# EAGLE design c200_rev_a (EAGLE 6.1)
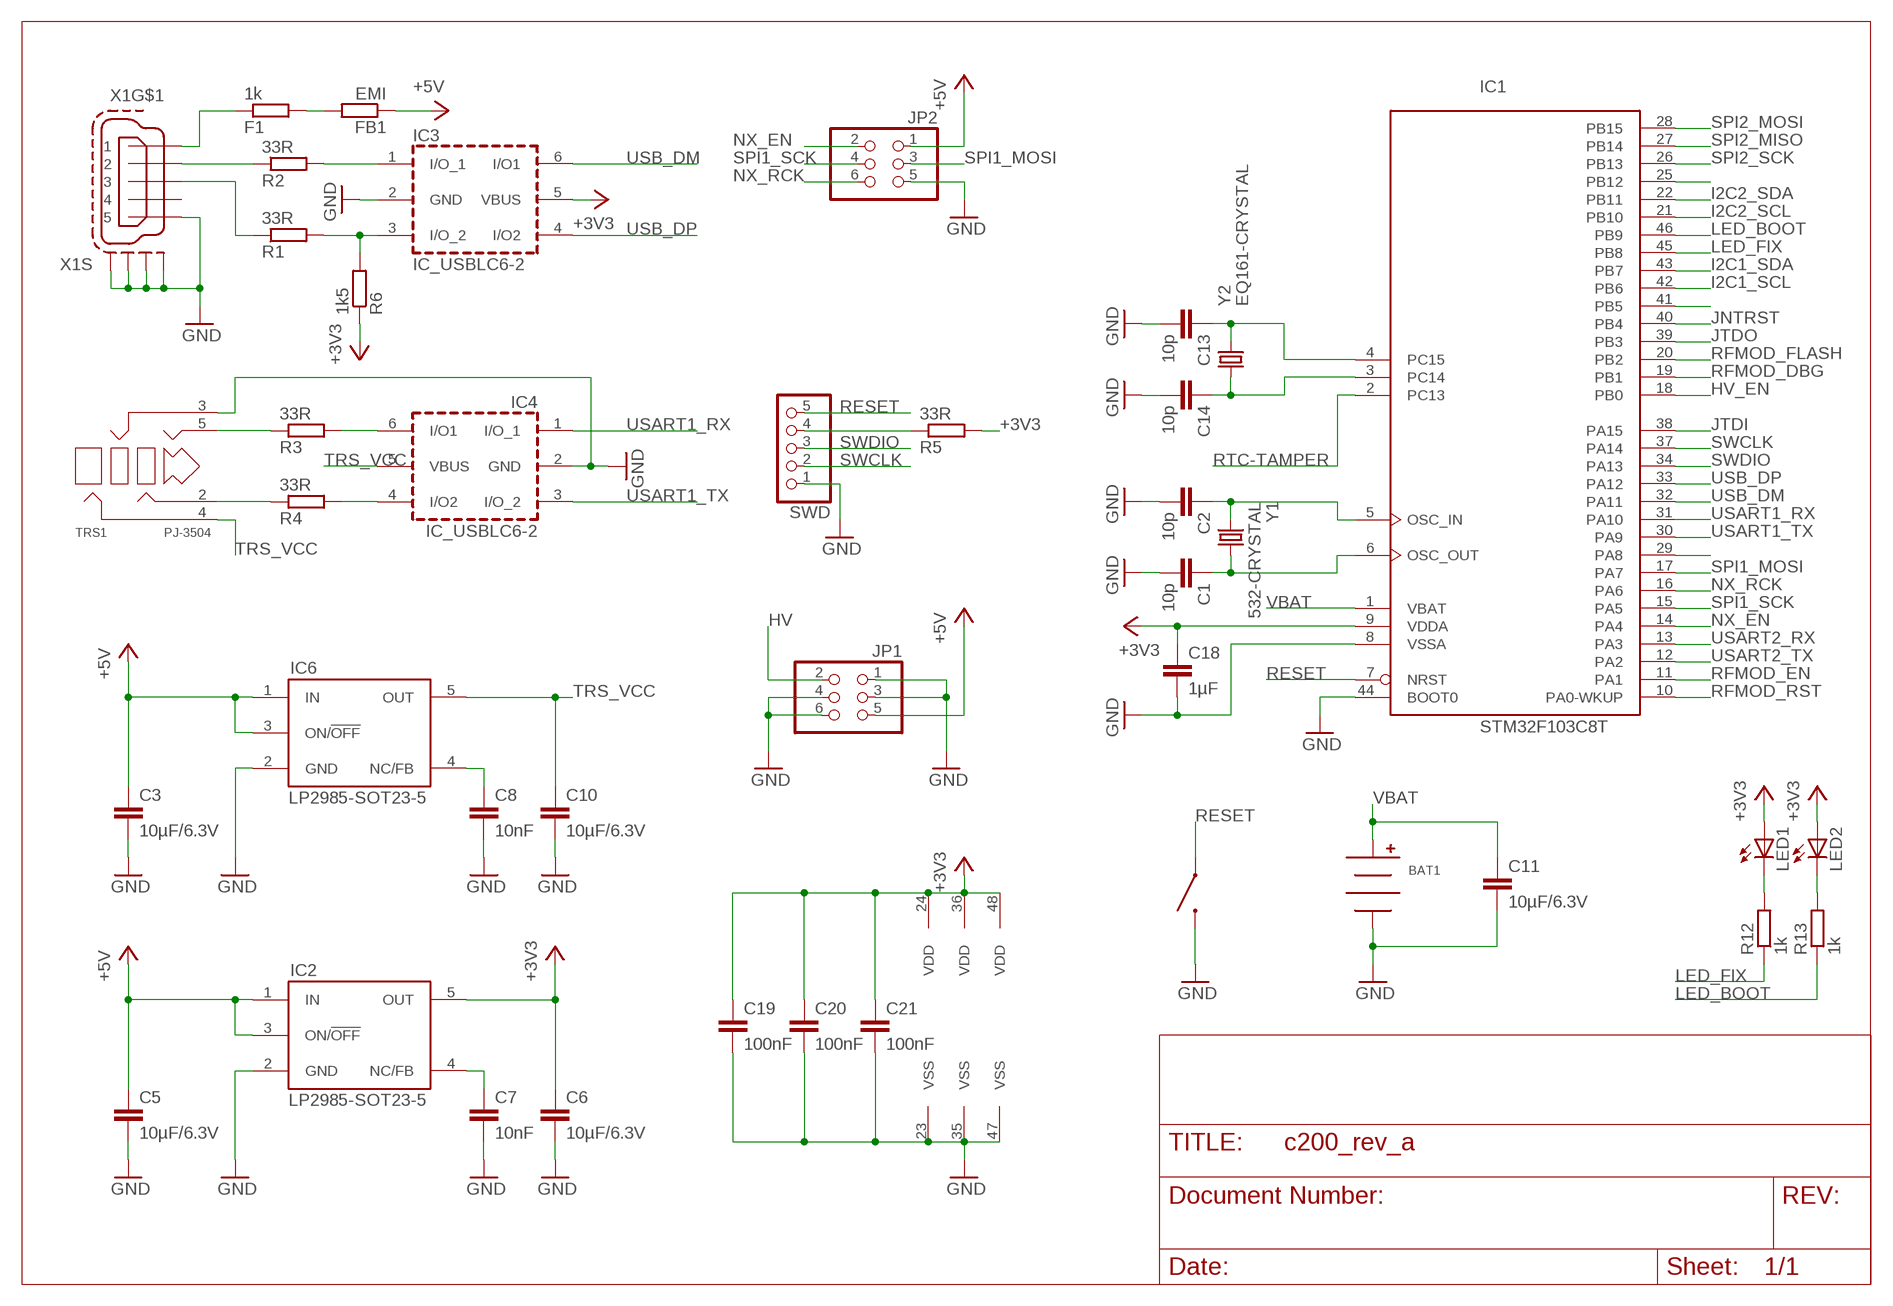
[diagram p0: schematic, sheet 1, part 1 of 2]
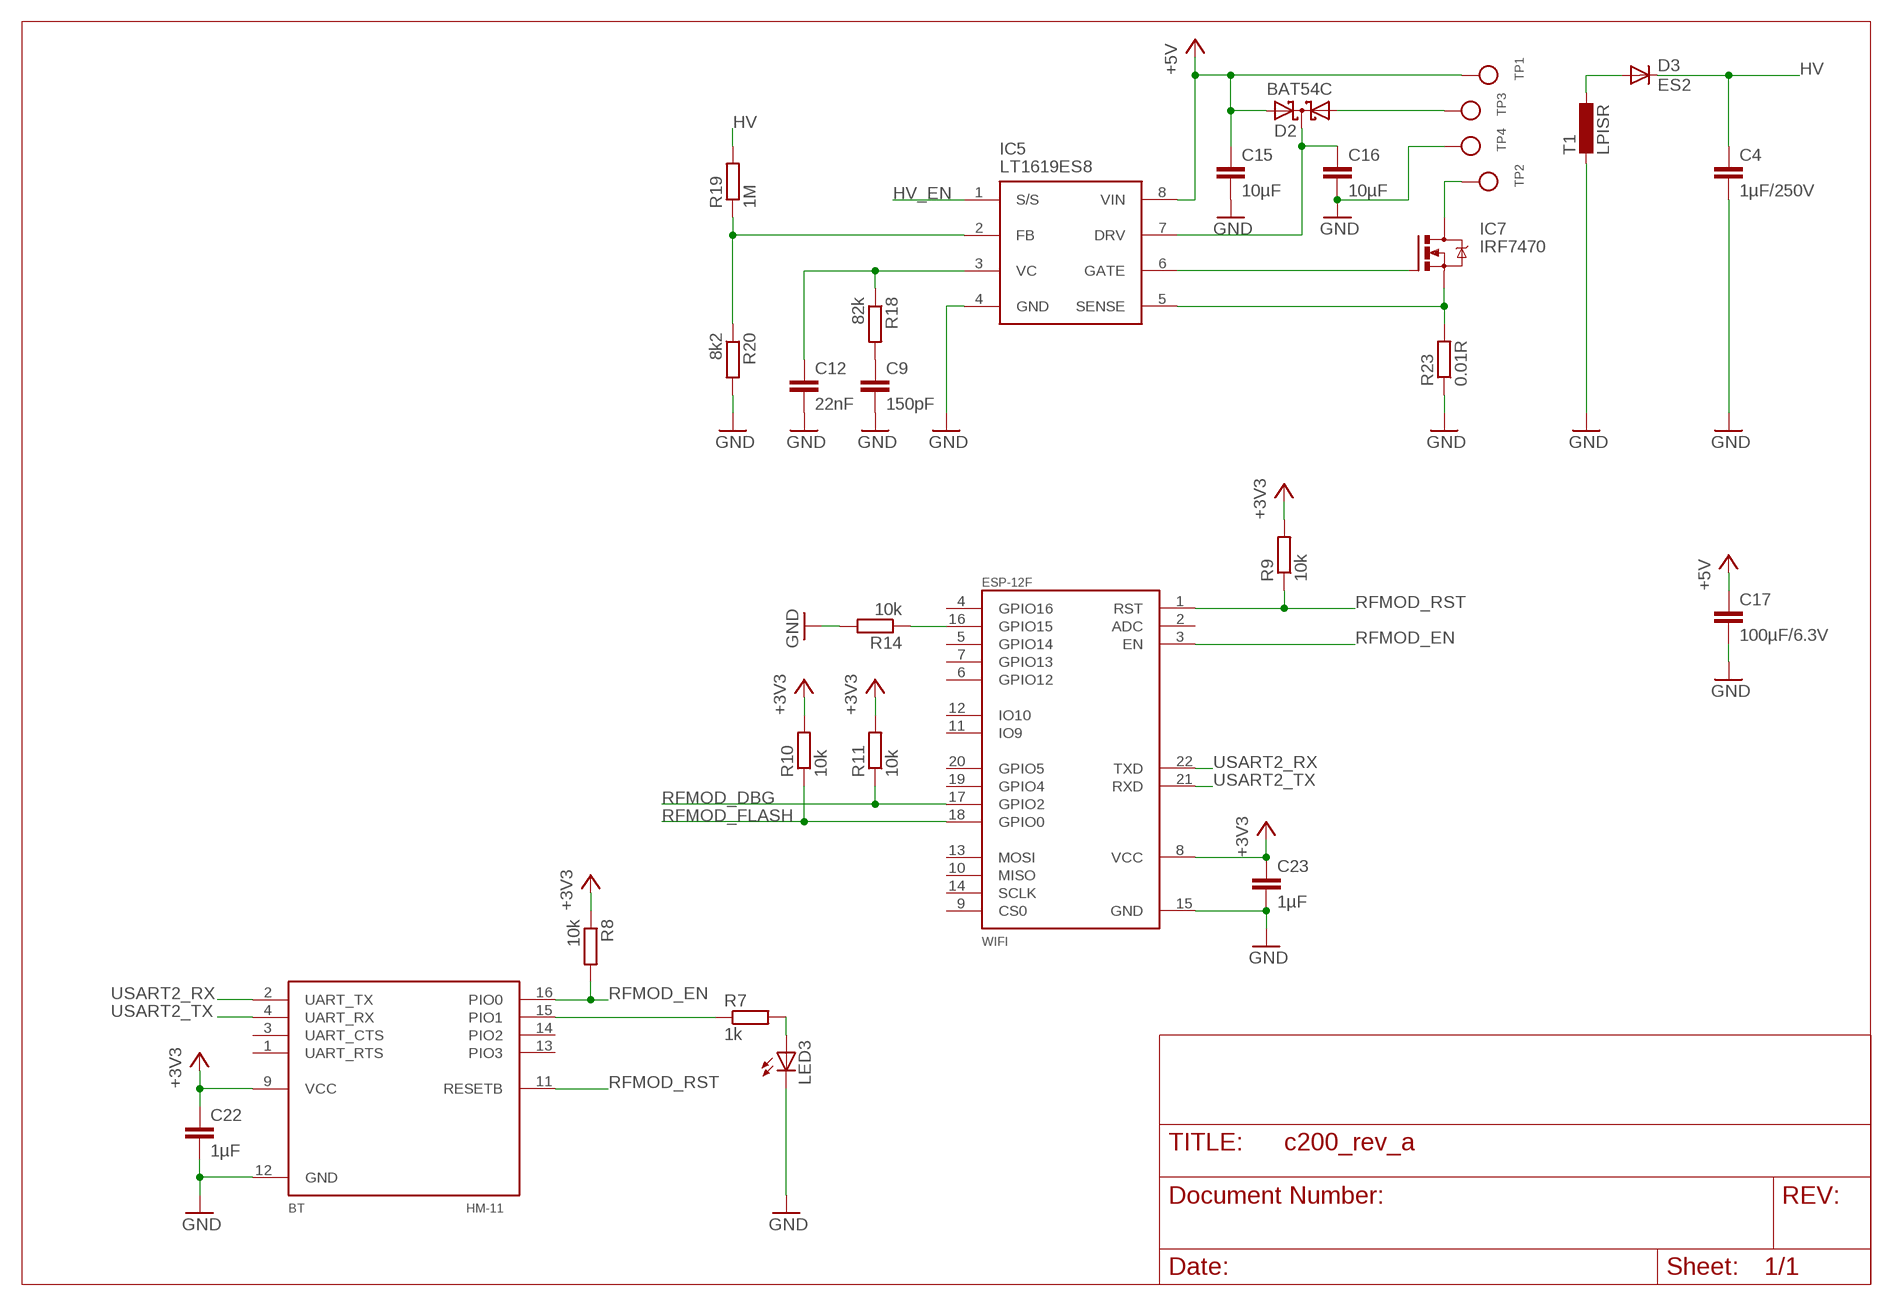
[diagram p1: schematic, sheet 1, part 2 of 2]

## Parts
BAT1  CR1220-HOLDER  [HARWIN-CR1220]
BT  HM-11  [HM-11]
C1  10p  C-EUC0603  [C0603]
C2  10p  C-EUC0603  [C0603]
C3  10µF/6.3V  C-EUC0603  [C0603]
C4  1µF/250V  C-EUC2220K  [C2220K]
C5  10µF/6.3V  C-EUC0603  [C0603]
C6  10µF/6.3V  C-EUC0603  [C0603]
C7  10nF  C-EUC0603  [C0603]
C8  10nF  C-EUC0603  [C0603]
C9  150pF  C-EUC0603  [C0603]
C10  10µF/6.3V  C-EUC0603  [C0603]
C11  10µF/6.3V  C-EUC0603  [C0603]
C12  22nF  C-EUC0603  [C0603]
C13  10p  C-EUC0603  [C0603]
C14  10p  C-EUC0603  [C0603]
C15  10µF  C-EUC0603  [C0603]
C16  10µF  C-EUC0603  [C0603]
C17  100µF/6.3V  C-EUC1210  [C1210]
C18  1µF  C-EUC0603  [C0603]
C19  100nF  C-EUC0603  [C0603]
C20  100nF  C-EUC0603  [C0603]
C21  100nF  C-EUC0603  [C0603]
C22  1µF  C-EUC0603  [C0603]
C23  1µF  C-EUC0603  [C0603]
D2  BAT54C  [SOT23]
D3  ES2  [DO-214AA]
F1  1k  R-EU_R0603  [R0603]
FB1  EMI  R-EU_R0603  [R0603]
IC1  STM32F103C8T  [LQFP48]
IC2  LP2985-SOT23-5  [SOT23-5]
IC3  IC_USBLC6-2  [SOT-23-6L]
IC4  IC_USBLC6-2  [SOT-23-6L]
IC5  LT1619ES8  [SO8]
IC6  LP2985-SOT23-5  [SOT23-5]
IC7  IRF7470  [SO8]
ISP  TACT-SWITCH-40-40  [40-40]
JP1  PINHD-2X3_2.54-SMD  [2X03SMD]
JP2  PINHD-2X3_2.54-SMD  [2X03SMD]
LED1  LEDCHIP-LED0603  [CHIP-LED0603]
LED2  LEDCHIP-LED0603  [CHIP-LED0603]
LED3  LEDCHIP-LED0603  [CHIP-LED0603]
R1  33R  R-EU_R0603  [R0603]
R2  33R  R-EU_R0603  [R0603]
R3  33R  R-EU_R0603  [R0603]
R4  33R  R-EU_R0603  [R0603]
R5  33R  R-EU_R0603  [R0603]
R6  1k5  R-EU_R0603  [R0603]
R7  1k  R-EU_R0603  [R0603]
R8  10k  R-EU_R0603  [R0603]
R9  10k  R-EU_R0603  [R0603]
R10  10k  R-EU_R0603  [R0603]
R11  10k  R-EU_R0603  [R0603]
R12  1k  R-EU_R0603  [R0603]
R13  1k  R-EU_R0603  [R0603]
R14  10k  R-EU_R0603  [R0603]
R18  82k  R-EU_R0603  [R0603]
R19  1M  R-EU_M1206  [M1206]
R20  8k2  R-EU_R0603  [R0603]
R23  0.01R  R-EU_R1206  [R1206]
SWD  HEADER-1X5ROUND  [1X05_ROUND]
T1  LPISR  [PISR]
TP1  TESTPOINTROUND2MM  [TESTPOINT_ROUND_2MM]
TP2  TESTPOINTROUND2MM  [TESTPOINT_ROUND_2MM]
TP3  TESTPOINTROUND2MM  [TESTPOINT_ROUND_2MM]
TP4  TESTPOINTROUND2MM  [TESTPOINT_ROUND_2MM]
TRS1  PJ-3504  [YD-PJ-3504]
WIFI  ESP-12F  [ESP-12F]
X1  MINI-USB-SCHIELD-32005-201  [32005-201]
Y1  532-CRYSTAL  [2PIN50X32]
Y2  EQ161-CRYSTAL  [EQ161]

## Nets
+3V3: BT.9(VCC) C6.1 C18.1 C19.1 C20.1 C21.1 C22.1 C23.1 IC1.9(VDDA) IC1.24(VDD) IC1.36(VDD) IC1.48(VDD) IC2.5(OUT) IC3.5(VBUS) LED1.A LED2.A R5.2 R6.1 R8.1 R9.2 R10.2 R11.2 WIFI.8(VCC)
+5V: C3.1 C5.1 C15.1 C17.1 D2.2(A2) FB1.1 IC2.1(IN) IC2.3(ON/!OFF) IC5.8(VIN) IC6.1(IN) IC6.3(ON/!OFF) JP1.5 JP2.1 TP1.P$1
ASDAWJIODJA: R5.1 SWD.4
GND: BAT1.NEG BT.12(GND) C1.2 C2.2 C3.2 C4.2 C5.2 C6.2 C7.2 C8.2 C9.2 C10.2 C11.2 C12.2 C13.2 C14.2 C15.2 C16.2 C17.2 C18.2 C19.2 C20.2 C21.2 C22.2 C23.2 IC1.8(VSSA) IC1.23(VSS) IC1.35(VSS) IC1.44(BOOT0) IC1.47(VSS) IC2.2(GND) IC3.2(GND) IC4.2(GND) IC5.4(GND) IC6.2(GND) ISP.1 ISP.2 JP1.1 JP1.3 JP1.4 JP1.6 JP2.5 LED3.C R14.2 R20.2 R23.1 SWD.1 T1.P$2 TP4.P$1 TRS1.3 WIFI.15(GND) X1.5 X1.M1(S:S1) X1.M2(S:S2) X1.M3(S:S3) X1.M4(S:S4)
HV: C4.1 D3.C JP1.2 R19.2
HV_EN: IC1.18(PB0) IC5.1(S/S)
I2C1_SCL: IC1.42(PB6)
I2C1_SDA: IC1.43(PB7)
I2C2_SCL: IC1.21(PB10)
I2C2_SDA: IC1.22(PB11)
JNTRST: IC1.40(PB4)
JTDI: IC1.38(PA15)
JTDO: IC1.39(PB3)
LED_BOOT: IC1.46(PB9) R13.1
LED_FIX: IC1.45(PB8) R12.1
N$1: C1.1 IC1.6(OSC_OUT) Y1.P$1
N$2: C2.1 IC1.5(OSC_IN) Y1.P$2
N$3: F1.1 X1.1
N$4: C8.1 IC6.4(NC/FB)
N$5: IC3.3(I/O_2) R1.2 R6.2
N$6: R14.1 WIFI.16(GPIO15)
N$7: IC4.6(I/O1) R3.2
N$8: D2.1(A1) TP3.P$1
N$9: IC5.6(GATE) IC7.4(G)
N$10: LED2.C R13.2
N$11: LED1.C R12.2
N$12: R4.1 TRS1.2
N$13: IC7.5(D) IC7.6(D) IC7.7(D) IC7.8(D) TP2.P$1
N$14: C12.1 IC5.3(VC) R18.1
N$15: C9.1 R18.2
N$16: D3.A T1.P$1
N$17: IC5.2(FB) R19.1 R20.1
N$18: IC5.5(SENSE) IC7.1(S) IC7.2(S) IC7.3(S) R23.2
N$19: C16.1 D2.3(CC) IC5.7(DRV)
N$20: C7.1 IC2.4(NC/FB)
N$22: F1.2 FB1.2
N$23: IC3.1(I/O_1) R2.2
N$24: R2.1 X1.2
N$25: IC4.4(I/O2) R4.2
N$26: BT.15(PIO1) R7.1
N$27: LED3.A R7.2
N$28: R3.1 TRS1.5
N$29: C13.1 IC1.4(PC15) Y2.P$1
N$30: C14.1 IC1.3(PC14) Y2.P$2
N$36: R1.1 X1.3
N$38: IC1.29(PA8)
N$48: IC1.41(PB5)
N$55: IC1.25(PB12)
NX_EN: IC1.14(PA4) JP2.2
NX_RCK: IC1.16(PA6) JP2.6
RESET: IC1.7(NRST) ISP.3 ISP.4 SWD.5
RFMOD_DBG: IC1.19(PB1) R11.1 WIFI.17(GPIO2)
RFMOD_EN: BT.16(PIO0) IC1.11(PA1) R8.2 WIFI.3(EN)
RFMOD_FLASH: IC1.20(PB2) R10.1 WIFI.18(GPIO0)
RFMOD_RST: BT.11(RESETB) IC1.10(PA0-WKUP) R9.1 WIFI.1(RST)
RTC-TAMPER: IC1.2(PC13)
SPI1_MOSI: IC1.17(PA7) JP2.3
SPI1_SCK: IC1.15(PA5) JP2.4
SPI2_MISO: IC1.27(PB14)
SPI2_MOSI: IC1.28(PB15)
SPI2_SCK: IC1.26(PB13)
SWCLK: IC1.37(PA14) SWD.2
SWDIO: IC1.34(PA13) SWD.3
TRS_VCC: C10.1 IC4.5(VBUS) IC6.5(OUT) TRS1.4
USART1_RX: IC1.31(PA10) IC4.1(I/O_1)
USART1_TX: IC1.30(PA9) IC4.3(I/O_2)
USART2_RX: BT.2(UART_TX) IC1.13(PA3) WIFI.22(TXD)
USART2_TX: BT.4(UART_RX) IC1.12(PA2) WIFI.21(RXD)
USB_DM: IC1.32(PA11) IC3.6(I/O1)
USB_DP: IC1.33(PA12) IC3.4(I/O2)
VBAT: BAT1.POS C11.1 IC1.1(VBAT)
Unconnected: BT.1(UART_RTS) BT.3(UART_CTS) BT.13(PIO3) BT.14(PIO2) WIFI.2(ADC) WIFI.4(GPIO16) WIFI.5(GPIO14) WIFI.6(GPIO12) WIFI.7(GPIO13) WIFI.9(CS0) WIFI.10(MISO) WIFI.11(IO9) WIFI.12(IO10) WIFI.13(MOSI) WIFI.14(SCLK) WIFI.19(GPIO4) WIFI.20(GPIO5) X1.4

## Library data of the parts
BAT1 = battery-holder:CR1220-HOLDER
BT = bt:HM-11
C1-C23 = rcl:C-EU: CAPACITOR, European symbol
D2 = diode:BAT54C: Schottky Diodes Source: Fairchild .. BAT54.pdf
D3 = diode:ES2
F1 FB1 R1-R14 R18-R20 R23 = rcl:R-EU_: RESISTOR, European symbol
IC1 = micro-stm_v3:STM32F103C*T: ARM 32-bit Cortex™-M3 CPU 72 MHz maximum frequency 16 to 128 Kbytes of Flash memory 6 to 20 kbytes of SRAM 37 GPIOs 2.0 to 3.6 V application supply
IC2 IC6 = vreg:LP2985
IC3 IC4 = dp_devices:IC_USBLC6-2
IC5 = lt:LT1619
IC7 = ir:IRF7470
ISP = tactile-switch:TACT-SWITCH-40-40
JP1 JP2 = con-pinhead:PINHD-2X3: PIN HEADER
LED1-LED3 = led:LED: LED OSRAM: - CHIPLED LG R971, LG N971, LY N971, LG Q971, LY Q971, LO R971, LY R971 LH N974, LH R974 LS Q976, LO Q976, LY Q976 LO Q996 - Hyper CHIPLED LW Q18S LB Q993, LB Q99A, LB R99A - SideLED LS A670, LO A670, LY A670, LG A670, LP A670 LB A673, LV A673, LT A673, LW A673 LH A674 LY A675 LS A676, LA A676, LO A676, LY A676, LW A676 LS A679, LY A679, LG A679 - Hyper Micro SIDELED® LS Y876, LA Y876, LO Y876, LY Y876 LT Y87S - SmartLED LW L88C, LW L88S LB L89C, LB L89S, LG L890 LS L89K, LO L89K, LY L89K LS L896, LA L896, LO L896, LY L896 - TOPLED LS T670, LO T670, LY T670, LG T670, LP T670 LSG T670, LSP T670, LSY T670, LOP T670, LYG T670 LG T671, LOG T671, LSG T671 LB T673, LV T673, LT T673, LW T673 LH T674 LS T676, LA T676, LO T676, LY T676, LB T676, LH T676, LSB T676, LW T676 LB T67C, LV T67C, LT T67C, LS T67K, LO T67K, LY T67K, LW E67C LS E67B, LA E67B, LO E67B, LY E67B, LB E67C, LV E67C, LT E67C LW T67C LS T679, LY T679, LG T679 LS T770, LO T770, LY T770, LG T770, LP T770 LB T773, LV T773, LT T773, LW T773 LH T774 LS E675, LA E675, LY E675, LS T675 LS T776, LA T776, LO T776, LY T776, LB T776 LHGB T686 LT T68C, LB T68C - Hyper Mini TOPLED® LB M676 - Mini TOPLED Santana® LG M470 LS M47K, LO M47K, LY M47K Source: http://www.osram.convergy.de LUXEON: - LUMILED® LXK2-PW12-R00, LXK2-PW12-S00, LXK2-PW14-U00, LXK2-PW14-V00 LXK2-PM12-R00, LXK2-PM12-S00, LXK2-PM14-U00 LXK2-PE12-Q00, LXK2-PE12-R00, LXK2-PE12-S00, LXK2-PE14-T00, LXK2-PE14-U00 LXK2-PB12-K00, LXK2-PB12-L00, LXK2-PB12-M00, LXK2-PB14-N00, LXK2-PB14-P00, LXK2-PB14-Q00 LXK2-PR12-L00, LXK2-PR12-M00, LXK2-PR14-Q00, LXK2-PR14-R00 LXK2-PD12-Q00, LXK2-PD12-R00, LXK2-PD12-S00 LXK2-PH12-R00, LXK2-PH12-S00 LXK2-PL12-P00, LXK2-PL12-Q00, LXK2-PL12-R00 Source: www.luxeon.com KINGBRIGHT: KA-3528ASYC Source: www.kingbright.com
SWD = microbuilder:HEADER-1X5: PIN HEADER
T1 = fastron:L
TP1-TP4 = microbuilder:TESTPOINT: Test Point Various test points for characterisation and PCB testing TESTPOINT_SMT - Compact Surface Mount Test Point [Digikey: 5016KTR-ND]
TRS1 = con-trs:PJ-3504
WIFI = espressif:ESP-12F
X1 = con-cypressindustries:MINI-USB-SCHIELD-: MINI USB-B Conector Source: www.cypressindustries.com; OC_FARNELL: unknown; OC_NEWARK: unknown
Y1 = euroquartz:532-CRYSTAL
Y2 = euroquartz:EQ161-CRYSTAL: ￼Miniature SMD 3.2 x 1.5 x 0.75mm

## Board
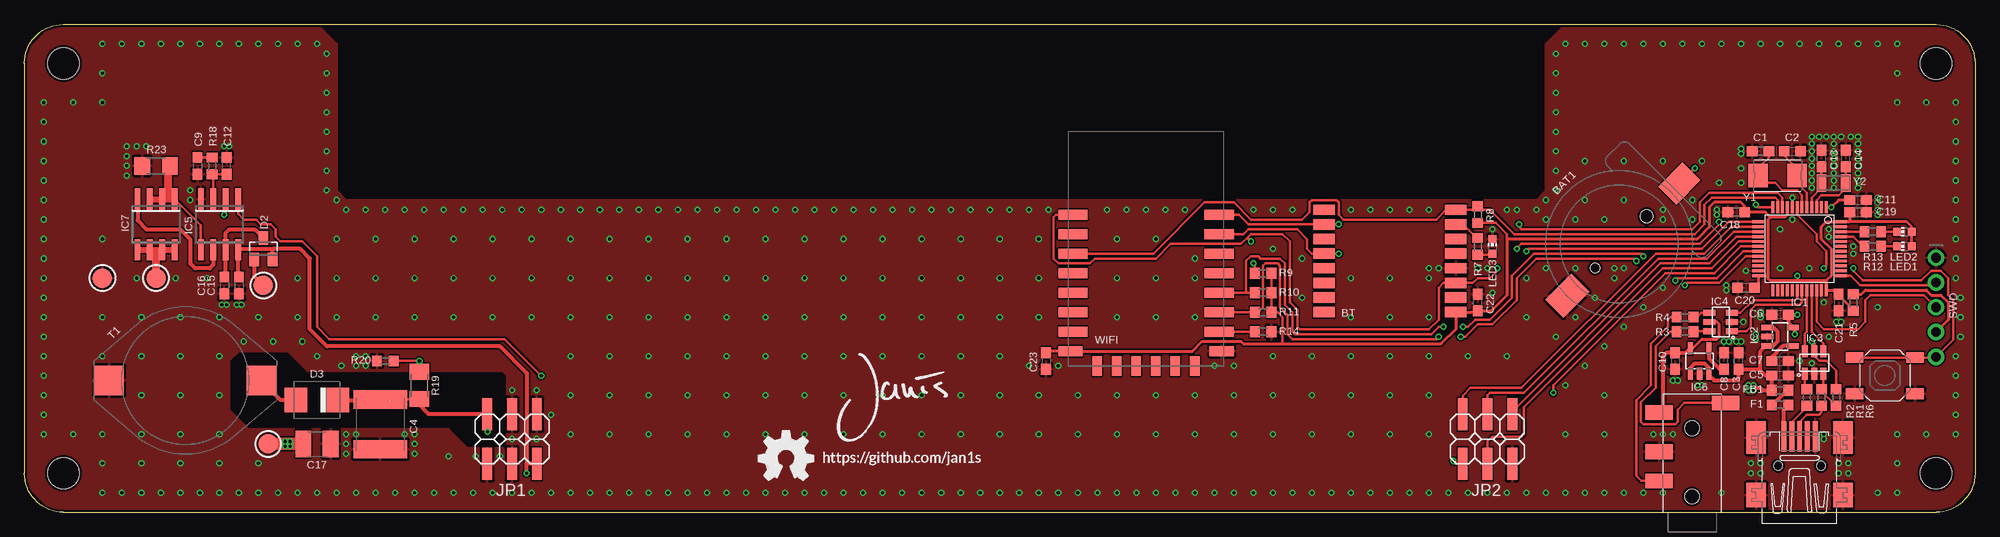
[diagram p2: board, top side]
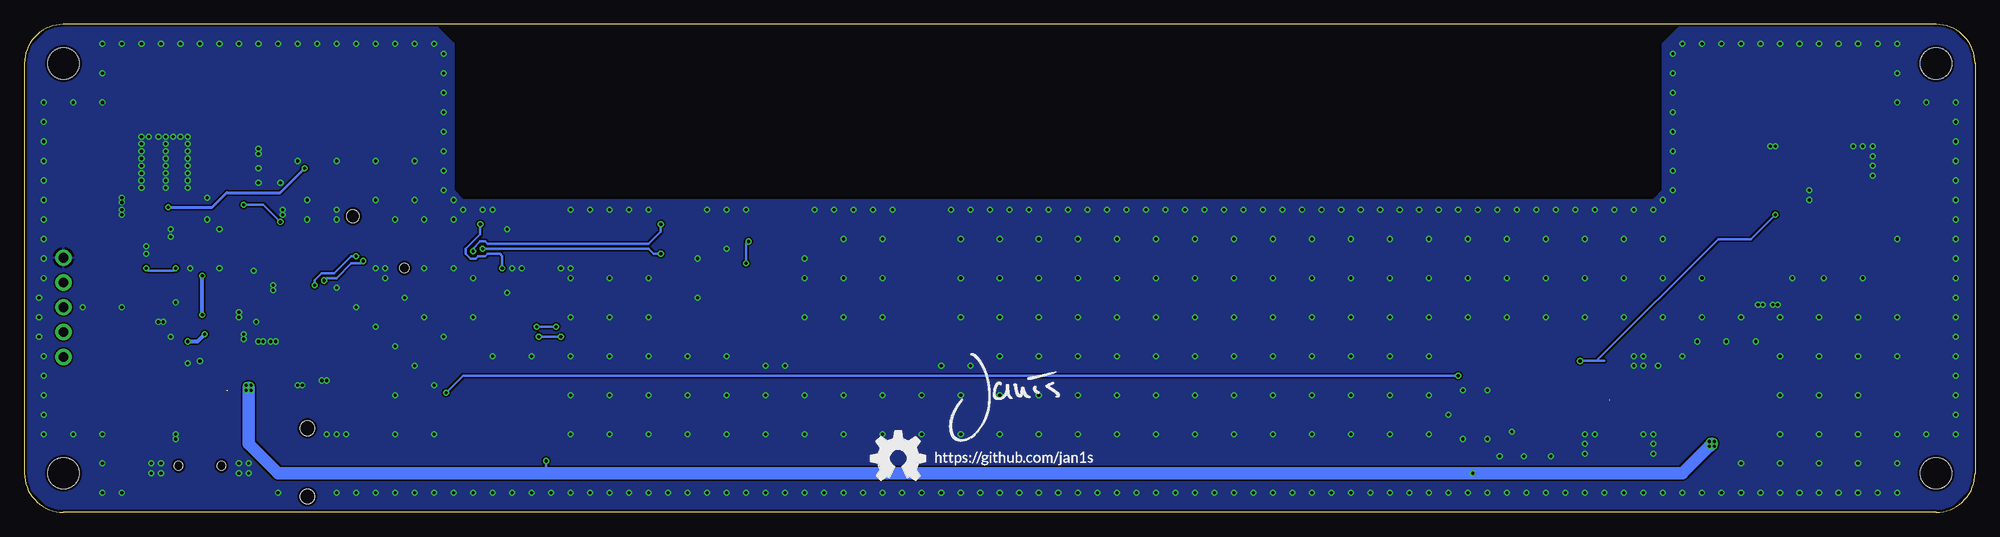
[diagram p3: board, bottom side, seen from below]

Size 200 x 50 mm. Coordinates in mm from the lower left corner, seen from the top.
Outline: 4,0 196,0 arc90 200,4 200,46 arc90 196,50 4,50 arc90 0,46 0,4 arc90 4,0
Copper layers (1*16): Top 0.035mm / dielectric 1.5mm / Bottom 0.035mm
Design rules: minimum track width 6mil, minimum drill 12mil, track to track 6mil, track to pad 6mil, pad to pad 6mil, via to via 6mil, smd to smd 0mil, copper to edge 10mil, drill to drill 10mil, minimum pad ring 10mil, minimum via ring 6mil, stop-mask expansion 2mil, vias tented up to drill 100mil, thermal gap 10mil
Holes 3.2 mm at 4,46 196,46 196,4 4,4

### Footprints (pad centres in the part's own frame; a part is rotated, then mirrored left to right if it is on the bottom)
HARWIN-CR1220 = smd 2.6 x 3.75: NEG 0,7.5 | smd 2.6 x 3.5: POS 0,-8.75 | hole 1: 0,3.5 | hole 1.3: 0,-4
HM-11 = smd 2.184 x 1.067: 1 -6.75,0; 2 -6.75,-1.5; 3 -6.75,-3; 4 -6.75,-4.5; 5 -6.75,-6; 6 -6.75,-7.5; 7 -6.75,-9; 8 -6.75,-10.5; 9 6.75,-10.5; 10 6.75,-9; 11 6.75,-7.5; 12 6.75,-6; 13 6.75,-4.5; 14 6.75,-3; 15 6.75,-1.5; 16 6.75,0
C0603 = smd 1.1 x 1: 1 -0.85,0; 2 0.85,0
C2220K = smd 1.85 x 5.5: 1 -2.55,0; 2 2.55,0
C1210 = smd 1.6 x 2.7: 1 -1.4,0; 2 1.4,0
SOT23 = smd 1 x 1.4: 1 -0.95,-1.1; 2 0.95,-1.1; 3 0,1.1
DO-214AA = smd 2.3 x 2.5: A 2.15,0; C -2.15,0
R0603 = smd 1 x 1.1: 1 -0.85,0; 2 0.85,0
LQFP48 = smd 0.3 x 1.2: 1 -2.75,-4.25; 2 -2.25,-4.25; 3 -1.75,-4.25; 4 -1.25,-4.25; 5 -0.75,-4.25; 6 -0.25,-4.25; 7 0.25,-4.25; 8 0.75,-4.25; 9 1.25,-4.25; 10 1.75,-4.25; 11 2.25,-4.25; 12 2.75,-4.25; 25 2.75,4.25; 26 2.25,4.25; 27 1.75,4.25; 28 1.25,4.25; 29 0.75,4.25; 30 0.25,4.25; 31 -0.25,4.25; 32 -0.75,4.25; 33 -1.25,4.25; 34 -1.75,4.25; 35 -2.25,4.25; 36 -2.75,4.25 | smd 1.2 x 0.3: 13 4.25,-2.75; 14 4.25,-2.25; 15 4.25,-1.75; 16 4.25,-1.25; 17 4.25,-0.75; 18 4.25,-0.25; 19 4.25,0.25; 20 4.25,0.75; 21 4.25,1.25; 22 4.25,1.75; 23 4.25,2.25; 24 4.25,2.75; 37 -4.25,2.75; 38 -4.25,2.25; 39 -4.25,1.75; 40 -4.25,1.25; 41 -4.25,0.75; 42 -4.25,0.25; 43 -4.25,-0.25; 44 -4.25,-0.75; 45 -4.25,-1.25; 46 -4.25,-1.75; 47 -4.25,-2.25; 48 -4.25,-2.75
SOT23-5 = smd 0.55 x 1.2: 1 -0.95,-1.3; 2 0,-1.3; 3 0.95,-1.3; 4 0.95,1.3; 5 -0.95,1.3
SOT-23-6L = smd 0.6 x 1.2: 1 -0.95,-2.3; 2 0,-2.3; 3 0.95,-2.3; 4 0.95,0; 5 0,0; 6 -0.95,0
SO8 = smd 0.6 x 2.2: 1 -1.905,-2.6; 2 -0.635,-2.6; 3 0.635,-2.6; 4 1.905,-2.6; 5 1.905,2.6; 6 0.635,2.6; 7 -0.635,2.6; 8 -1.905,2.6
40-40 = smd 1.8 x 1.1: 1 -3.1,1.85; 2 3.1,1.85; 3 -3.1,-1.85; 4 3.1,-1.85
2X03SMD = smd 1.016 x 3.302: 1 -2.54,-2.54; 2 -2.54,2.54; 3 0,-2.54; 4 0,2.54; 5 2.54,-2.54; 6 2.54,2.54
CHIP-LED0603 = smd 0.8 x 0.8: A 0,-0.75; C 0,0.75
M1206 = smd 1.6 x 2: 1 -1.4,0; 2 1.4,0
R1206 = smd 1.6 x 1.803: 1 -1.422,0; 2 1.422,0
1X05_ROUND = drill 1 pad 1.676: 1 -5.08,0; 2 -2.54,0; 3 0,0; 4 2.54,0; 5 5.08,0
PISR = smd 3 x 3: P$1 7.8,0; P$2 -7.8,0
TESTPOINT_ROUND_2MM = smd 2 x 2: P$1 0,0
YD-PJ-3504 = smd 1.5 x 2.8: 2 3.2,3.4; 3 6.2,3.4; 4 10.2,3.4; 5 11.2,-3.4 | hole 1.5: 1.6,0; 8.6,0
ESP-12F = smd 3 x 1: 1 -7.5,-8.5; 2 -7.5,-10.5; 3 -7.5,-12.5; 4 -7.5,-14.5; 5 -7.5,-16.5; 6 -7.5,-18.5; 7 -7.5,-20.5; 16 7.5,-20.5; 17 7.5,-18.5; 18 7.5,-16.5; 19 7.5,-14.5; 20 7.5,-12.5; 21 7.5,-10.5; 22 7.5,-8.5 | smd 2.5 x 1: 8 -7.75,-22.5; 15 7.75,-22.5 | smd 1 x 2: 9 -5,-24; 10 -3,-24; 11 -1,-24; 12 1,-24; 13 3,-24; 14 5,-24
32005-201 = smd 3.1 x 0.5: 1 3,1.6; 2 3,0.8; 3 3,0; 4 3,-0.8; 5 3,-1.6 | smd 2.5 x 2: M1 -3,-4.45; M2 -3,4.45 | smd 3.3 x 2: M3 2.9,4.45; M4 2.9,-4.45 | hole 0.9: 0,2.2; 0,-2.2
2PIN50X32 = smd 2 x 2.4: P$1 -2,0; P$2 2,0
EQ161 = smd 1 x 1.8: P$1 -1.25,0; P$2 1.25,0

### Placement (x,y rotation side)
BAT1  163.5,27.5 135 top
BT  140,31 0 top
C1  178,37 180 top
C2  181.25,37 0 top
C3  175.75,15.5 90 top
C4  36.5,9 270 top
C5  180,14 0 top
C6  180,20.25 180 top
C7  180,15.5 0 top
C8  174.25,15.5 90 top
C9  17.75,35.5 270 top
C10  169.25,15.5 270 top
C11  188,32 0 top
C12  20.75,35.5 90 top
C13  184.25,36.25 90 top
C14  186.75,36.25 90 top
C15  22,23.25 270 top
C16  20.5,23.25 270 top
C17  30,7 0 top
C18  175.5,30.75 180 top
C19  188,30.75 0 top
C20  176.5,23 180 top
C21  186,21.5 270 top
C22  149,21.5 90 top
C23  104.75,15.5 270 top
D2  24.5,27 0 top
D3  30,11.5 180 top
F1  180,11 180 top
FB1  180,12.5 0 top
IC1  182,27 180 top
IC2  180,18 270 top
IC3  183.5,16.5 0 top
IC4  172.75,19.5 90 top
IC5  20,29.5 180 top
IC6  171.75,15.5 0 top
IC7  13.5,29.5 180 top
ISP  190.75,14 180 top
JP1  50,7.5 0 top
JP2  150,7.5 0 top
LED1  192.75,27.25 90 top
LED2  192.75,28.75 90 top
LED3  150.5,27.25 0 top
LOGO1  OSHW_LOGO_FILLX0200-NT  [OSHW_FILLX200_NOTEXT]  113.25,3.25 0 bottom
LOGO2  OSHW_LOGO_FILLX0200-NT  [OSHW_FILLX200_NOTEXT]  75.25,3.25 0 top
R1  184.25,11.75 90 top
R2  182.75,11.75 90 top
R3  170.25,18.5 0 top
R4  170.25,20 0 top
R5  187.5,21.5 270 top
R6  185.75,11.75 270 top
R7  149,27.25 270 top
R8  149,30.5 90 top
R9  127,24.5 0 top
R10  127,22.5 0 top
R11  127,20.5 0 top
R12  189.5,27.25 0 top
R13  189.5,28.75 0 top
R14  127,18.5 0 top
R18  19.25,35.5 90 top
R19  40.5,13 270 top
R20  37,15.5 180 top
R23  13.5,35.5 0 top
SWD  196,21 270 top
T1  16.5,13.5 0 top
TP1  25,7 0 top
TP2  13.5,24 0 top
TP3  24.5,23.25 0 top
TP4  8,24 0 top
TRS1  171,0 90 top
U$1  [JANIS_10MM]  83,7 0 top
U$2  [JANIS_10MM]  105.5,7 0 bottom
U$5  [GITHUB/JAN1S]  81.75,5 0 top
U$6  [GITHUB/JAN1S]  106.75,5 0 bottom
WIFI  115,39 0 top
X1  182,4.75 90 top
Y1  179.75,34.5 0 top
Y2  185.5,33.75 0 top

### Tracks (layer width: path | path; a pad name or v marks a point on that pad's centre or on a via)
+3V3  (via drill 0.32)
  Top 0.254: R6.1 185.75,14.5 184.75,15.5 184,15.5 183.5,16 IC3.5 | R8.1 150.85,29.65 152,28.5 152,28 | 129,17.25 129,20 128.5,20.5 R11.2 R10.2 R9.2 | 104.9,16.5 104.5,16.5
  Top 0.305: C20.1 177.75,23.4 IC1.24 178.75,24.25 | IC1.9 180.75,30.5 180.5,30.25 179,30.25 | 179,30.25 178.5,30.75 C18.1 176.35,31.4 176,31.75 173.25,31.75 172.75,31.25 172.75,29.25 171.5,28 152,28 152,22.25 150.4,20.65 C22.1 148.35,20.5 BT.9 146.75,18.75 145.25,17.25 129,17.25 125,17.25 124.75,17.5 120.75,17.5 119.75,16.5 WIFI.8 104.9,16.5 C23.1 | LED1.A LED2.A 193.5,29.25 193,29.75 187,29.75 | 187,29.75 IC1.48 184.75,29.75 184.25,29.25 184.25,28 185.25,27 185.25,24.25 184.75,23.75 | 184.75,23.75 IC1.36 185.6,22.75 C21.1 186,22.25 187.5,20.75 R5.2 | 181.75,23.75 179,23.75 178.75,24 178.75,24.25 | 181.75,23.75 184.75,23.75 | v181.75,24.25 181.75,23.75 | C19.1 187.15,29.9 187,29.75 | 179,30.25 178.75,30 178.75,24.25
  Top 0.406: IC3.5 183.5,17.25 v183.25,17.5 | v181.5,18.25 181.5,18.75 IC2.5 180.85,19.4 C6.1 v181.75,20.25
  Bottom 0.406: v183.25,17.5 182.25,17.5 v181.5,18.25 | v181.75,20.25 v181.75,24.25
+5V  (via drill 0.32)  (1 unrouted)
  Top 0.254: JP2.1 146.79,4.96 v146.5,5.25
  Top 0.406: C15.1 21.91,24.85 IC5.8 22,27 25.5,27 | D2.2 25.45,26.95 25.5,27 | C17.1 27,7 v26.75,6.75 | 25.5,27 28.25,27 29.25,26 29.25,18.75 31,17 48.75,17 51.5,14.25 51.5,5 | FB1.1 C5.1 178.5,14 178,14.5 | 178,14.5 178,16.5 178.55,17.05 IC2.3 179.3,17.05 179.75,17.5 179.75,18.5 179.3,18.95 IC2.1 | IC6.1 170.8,14.8 171.25,15.25 172.25,15.25 172.7,14.8 IC6.3 172.7,14.05 173.25,13.5 175.5,13.5 175.75,13.75 C3.1 | 177.25,12.75 178,12.75 178.25,12.5 179.25,12.5 | C3.1 175.75,14.75 176,15 | C3.1 177.85,14.65 178,14.5 | 51.5,5 52.5,5 JP1.5 | v51.5,4 51.5,5
  Top 1.27: TP1.P$1 C17.1
  Bottom 0.254: 177,12.75 v176.75,13 | v146.5,5.25 146.5,4.25 146.25,4
  Bottom 0.406: 27,7 v26.75,6.75 v27.25,6.75 | 27,7 v27.25,7.25 | 27,7 v26.75,7.25
  Bottom 1.27: 27,7 v27.25,6.75 30,4 v51.5,4 146.25,4 174,4 177,7 177,12.75
  other vias: 177.25,13 177.25,12.5 176.75,12.5
  pour Top: 176.5,13 176.5,12.5 176.75,12.25 177.25,12.25 177.5,12.5 177.5,13 177.25,13.25 176.75,13.25
ASDAWJIODJA
  Top 0.305: R5.1 188.35,22.35 188.75,22.75 195,22.75 195.5,22.25 196.5,22.25 197.25,21.5 197.25,19.71 SWD.4
GND  (via drill 0.32)
  other vias: 198,16 198.5,18 192,5 198,14 198,12 52,2 192,48 188,48 186,48 184,48 182,48 180,48 176,48 174,48 172,48 166,48 164,48 162,48 160,48 158,48 22,48 20,48 18,48 16,48 14,48 12,48 10,48 8,48 2,34 2,32 2,30 2,28 2,26 2,24 2,22 2,20 2,18 2,16 2,14 2,12 2,10 2,8 8,2 10,2 12,2 14,2 16,2 18,2 20,2 22,2 24,2 26,2 28,2 30,2 32,2 34,2 36,2 38,2 42,2 44,2 50,2 154,2 156,2 158,2 160,2 198,34 198,32 198,30 168,48 170,48 192,2 190,2 195,8 198,28 198,26 198,24 198.5,22 198.5,20 46,2 48,2 40,2 178,48 190,48 20.5,37.5 17,32 17,33 18.75,24 10.5,35.5 10.5,36.5 10.5,37.5 11.5,37.5 12.5,37.5 10.5,34.5 20,20 16,20 12,20 12,12 16,12 20,12 16,8 12,8 12,5 16,5 33,8 33,7 34,8 39,8 40,8 40,7 43.5,5.75 40,6 16,16 28.5,17.5 20,16 35,15 34,16 30,16 35,16 20,8 20,5 12,16 32.5,15 34,15 8,8 5,8 8,5 8,42 8,45 5,42 8,16 24,5 8,28 11.5,24 33,6 22.5,17.5 15.5,24 25.5,17.5 8,20 192,8 198,8 198,10 176.25,19.5 174.25,17.5 174.75,17.5 181.25,30 181.25,32.25 173.5,31 185,29 186.25,19.5 162,2 164,2 166,2 168,2 174,2 192,45 192,42 195,42 168,36 180,25 172,36 173.5,30.5 176.5,24.75 174.5,23.25 174.5,22.75 184.5,21.5 185.75,19.5 185,28.25 187.5,27.25 187.5,26.5 190,31 190,30.5 185.5,33.25 185.5,34 185.5,34.75 185.5,35.5 185.5,36.25 185.5,37 185.5,37.75 185.5,38.5 186.25,38.5 187.25,38.5 184.75,38.5 184,38.5 188,33.25 188,34 188,34.75 188,35.5 188,36.25 188,37 188,37.75 188,38.5 183.25,34.75 176,36.75 176,37.25 183.25,38.5 183.25,37 183.25,37.75 183.25,36.25 183.25,34 183.25,33.25 183.25,35.5 178,20.5 178,20 177.5,18.25 177.5,17.75 183.25,15.25 182,15.5 169,13.5 169.5,13.5 175.5,17.5 176,17.5 171.5,13 172,13 177,4 178,4 186,4 187,4 184.5,8 184.5,7.5 186,5 187,5 178,5 177,5 167,8 168,8 169,8 47.5,8.25 48.75,5.75 46.25,5.75 50,12.5 150,25 149,25 150.5,29 164,32 168,31 171,32 52,20 160,32 160,36 164,36 32,20 40,20 36,20 44,20 48,20 154,20 56,20 144,20 136,24 140,20 140,24 31,47 31,37 32,32 33,31 31,35 31,33 35,31 37,31 39,31 136,31 138,31 140,31 142,31 144,31 157,39 157,37 157,35 157,33 156,32 155,31 153,31 144,25 145,25 144,24 180,29 183,25 185,18 190,21 194,21 150.5,22.5 152,31 164,25 168,23 158,13 160,15 162,17 164,19 166,21 163,24 161,22 159,20 157,18 152,16 154,24 156,25 156,30 159,30 159,25 163,25 162,30 168,30 171,30 20.25,21.25 20.75,21.25 21.75,21.25 22.25,21.25 21,37.5 190,31.75 190,32.25 173.75,33.75 176,33.75 176,35.25 24,48 26,48 28,48 30,48 54,2 56,2 58,2 60,2 62,2 64,2 66,2 68,2 70,2 72,2 74,2 76,2 78,2 80,2 132,2 134,2 136,2 138,2 140,2 142,2 144,2 146,2 148,2 150,2 152,2 52.5,12.5 54,10 52.5,7.5 50,7.5 41,31 43,31 45,31 47,31 49,31 51,31 53,31 57,31 55,31 59,31 61,31 63,31 65,31 67,31 69,31 71,31 73,31 75,31 77,31 79,31 81,31 32,24 36,24 40,24 44,24 48,24 52,24 56,24 56,16 60,16 60,20 64,20 64,20 64,16 60,24 64,24 24,20 28,20 28,24 56,12 60,12 64,12 56,8 60,8 64,8 68,24 68,20 68,16 68,12 68,8 72,8 72,12 72,16 72,20 72,24 76,24 76,20 76,16 76,12 76,8 80,20 80,24 80,16 80,12 80,8 32,28 36,28 40,28 44,28 48,28 52,28 56,28 60,28 64,28 68,28 72,28 76,28 132,8 136,8 136,12 132,12 132,16 136,16 140,16 140,12 140,8 144,16 148,16 80,28 144,8 144,12 158,8 162,8 162,12 2,36 2,38 2,40 2,42 31,39 31,41 31,43 31,45 198,36 198,38 198,40 198,42 157,41 157,43 157,45 157,47 84,16 84,20 84,24 84,28 88,28 88,24 88,20 88,16 84,12 88,12 88,8 84,8 82,2 84,2 86,2 88,2 90,2 92,2 94,2 96,2 98,2 100,2 102,2 104,2 106,2 108,2 110,2 112,2 114,2 116,2 118,2 120,2 122,2 124,2 126,2 128,2 130,2 92,8 92,12 96,12 96,8 100,8 100,12 104,12 104,8 108,8 108,12 112,12 112,8 116,8 116,12 120,12 120,8 124,8 124,12 128,12 128,8 83,31 85,31 87,31 89,31 91,31 93,31 95,31 97,31 99,31 101,31 103,31 105,31 113,31 115,31 117,31 119,31 126,31 128,31 128,27 130,31 136,20 92,16 96,16 100,16 92,20 96,20 100,20 92,24 96,24 100,24 92,28 96,28 100,28 112,20 112,24 112,28 116,28 116,24 116,20 120,20 120,24 120,26 128,16 111,31 131,26 131,22 122,15 124,15 103,15 106,15 104,28 104,24 104,20
  pour Top (rank 5): 3,50 30,50 32,48 32,33 33,32 155,32 156,33 156,48 158,50 197,50 200,47 200,3 197,0 49.5,0 49.5,14 49,14.5 29,14.5 27,16.5 22,16.5 21,15.5 21,10.5 23,8.5 43.5,8.5 45.5,6.5 45.5,0 3,0 0,3 0,47
  pour Bottom: 3,50 30,50 32,48 32,33 33,32 155,32 156,33 156,48 158,50 197,50 200,47 200,3 197,0 21.5,0 21.5,-2 16,-2 16,0 3,0 0,3 0,47
  pour Top: 45.5,0 49.5,0 49.5,6.5 45.5,6.5
HV  (1 unrouted)
  Top 0.254: R19.2 37.6,11.6 37.5,11.5
  Top 0.406: R19.2 40.45,11.55 40.45,11.05 41.45,10.05 JP1.2 47.5,10 | D3.C 37.45,11.5 C4.1
HV_EN  (via drill 0.32)
  Top 0.254: IC5.1 21.91,30.59 22.5,30 23.75,30 24.25,29.5 25.25,29.5 25.75,29 25.75,28.25 26.25,27.75 28.5,27.75 30,26.25 30,19 31.25,17.75 49.25,17.75 v53,14 | IC1.18 176,27.25 173.25,24.5 168.25,24.5 156.75,13 v156.75,12.25
  Bottom 0.254: v53,14 155,14 v156.75,12.25
LED_BOOT
  Top 0.254: IC1.46 R13.1
LED_FIX
  Top 0.254: IC1.45 187.5,28.25 188.5,27.25 R12.1
N$1
  Top 0.254: IC1.6 182.25,32.5 181.75,33 180.25,33 179.5,33.75 178.5,33.75 178.25,34 178.25,34.25 Y1.P$1 178,35.5 178.85,36.35 C1.1
N$2
  Top 0.254: IC1.5 182.75,32.75 181.75,33.75 Y1.P$2 182,35 180.4,36.6 C2.1
N$3
  Top 0.406: X1.1 180.4,10.55 F1.1
N$4
  Top 0.406: C8.1 173.85,14.65 172.7,15.8 IC6.4
N$5
  Top 0.254: IC3.3 184.45,12.8 R1.2 184.25,12.4 R6.2
N$6
  Top 0.254: WIFI.16 R14.1
N$7
  Top 0.254: IC4.6 171.15,18.55 R3.2
N$8
  Top 0.406: D2.1 23.55,24.2 TP3.P$1
N$9
  Top 0.406: IC7.4 11.6,29.91 12.5,29 16,29 17,28 17,25.5 17.5,25 19,25 19.36,25.36 IC5.6
N$10
  Top 0.254: R13.2 LED2.C
N$11
  Top 0.254: R12.2 LED1.C
N$12
  Top 0.254: TRS1.2 165.8,3.2 165.25,3.75 165.25,11.5 166.75,13 166.75,17.25 168.5,19 168.5,19.75 168.75,20 R4.1
N$13
  Top 0.406: 13.5,26.77 13,26.77 IC7.6
  Top 0.61: IC7.5 IC7.6 | IC7.6 12.9,26.9 13,27 | IC7.6 IC7.7 IC7.8
  Top 0.813: TP2.P$1 13.5,26.77
N$14
  Top 0.254: IC5.3 19.36,34.37 19.25,34.5 R18.1 C12.1
N$15
  Top 0.305: R18.2 C9.1
N$16
  Top 0.406: D3.A 26.3,11.5 T1.P$1
N$17  (via drill 0.32)
  Top 0.254: R19.1 v40.5,15.5 R20.1 | IC5.2 20.64,30.64 v20.5,30.5
  Bottom 0.254: 38.85,15.5 38,15.5 | v20.5,30.5 23,28 26.35,28 38.85,15.5 | 38.85,15.5 v40.5,15.5
N$18
  Top 0.254: IC5.5 18.09,29.41 IC7.1
  Top 0.61: IC7.3 IC7.2 | IC7.2 IC7.1 | IC7.2 14.71,32.1 14.75,32.14
  Top 0.813: 14.75,32.14 14.75,35.5 R23.2
N$19
  Top 0.406: C16.1 20.64,24.85 IC5.7 20.64,28.64 21,29 23.6,29 D2.3
N$20
  Top 0.406: C7.1 179.15,15.9 180.3,17.05 IC2.4
N$22
  Top 0.406: F1.2 179.25,11 180.75,12.5 FB1.2
N$23
  Top 0.254: IC3.1 182.55,12.8 R2.2
N$24
  Top 0.254: X1.2 181.2,9.2 182.75,10.75 R2.1
N$25
  Top 0.254: R4.2 171.5,20 171.95,20.45 IC4.4
N$26
  Top 0.254: BT.15 147.5,29.5 148.9,28.1 R7.1
N$27
  Top 0.254: R7.2 150.4,26.4 LED3.A
N$28
  Top 0.254: R3.1 168.75,18.5 167.25,17 167.25,12.75 165.75,11.25 165.75,9.25 166,9 169.25,9 169.5,9.25 169.5,10.5 170.2,11.2 TRS1.5
N$29
  Top 0.254: IC1.4 183.25,32.25 184.25,33.25 Y2.P$1 C13.1
N$30
  Top 0.254: IC1.3 183.75,32 184.25,32.5 186,32.5 186.75,33.25 Y2.P$2 C14.1
N$36
  Top 0.254: X1.3 182,9.25 182.75,10 184,10 184.25,10.25 R1.1
NX_EN
  Top 0.254: IC1.14 175,29.25 172.25,26.5 167.25,26.5 153.5,12.75 148.25,12.75 147.46,11.96 JP2.2
NX_RCK
  Top 0.254: IC1.16 175.5,28.25 172.75,25.5 167.75,25.5 152.54,10.29 JP2.6
RESET  (via drill 0.32)
  Top 0.254: IC1.7 181.75,30.5 183.75,28.5 183.75,27.75 184.75,26.75 184.75,25.25 v184.5,25 | v187.5,25 187.5,24.75 188.5,23.75 194.5,23.75 195.5,24.75 196.5,24.75 197.25,24 197.25,22.25 197.75,21.75 197.75,17.67 SWD.5 195.93,15.85 ISP.3 ISP.4
  Bottom 0.254: v184.5,25 184.75,24.75 187.25,24.75 v187.5,25
RFMOD_DBG  (via drill 0.32)
  Top 0.254: WIFI.17 R11.1 126.5,20.5 127,21 127,25.25 127.25,25.5 128.5,25.5 128.75,25.25 128.75,21 129.5,20.25 129.5,18.25 130,17.75 144.75,17.75 v145,18 | IC1.19 176.25,26.75 173.5,24 169.5,24 v169.25,23.75 | v165.25,25.75 165,26 155,26 153,24 153,21.75 150.5,19.25 149,19.25 147.75,18 v147.25,18
  Bottom 0.254: v169.25,23.75 169,24 168,24 166.5,25.5 165.5,25.5 v165.25,25.75 | v145,18 v147.25,18
RFMOD_EN
  Top 0.254: IC1.11 179.75,32 179.5,32.25 173,32.25 172.25,31.5 172.25,29.5 171.25,28.5 152.75,28.5 150.25,31 149.1,31 R8.2 148.9,31 BT.16 145.75,31 144.75,30 135.25,30 134.75,30.5 134.75,31.75 134.5,32 132,32 131.75,31.75 131.75,30.75 131,30 125.75,30 124,31.75 121,31.75 115.75,26.5 WIFI.3
RFMOD_FLASH  (via drill 0.32)
  Top 0.254: WIFI.18 125.25,22.5 | 125.25,22.5 R10.1 | IC1.20 176.5,26.25 173.75,23.5 170.5,23.5 v170.25,23.25 | v166,26.25 165.75,26.5 154.75,26.5 152.5,24.25 152.5,22 150.25,19.75 148.75,19.75 148,19 v147.5,19 | v145.5,19 145,19 144.25,18.25 130.25,18.25 130,18.5 130,20.5 129.25,21.25 129.25,25.5 128.75,26 126.75,26 126.5,26.25 125.75,26.25 125.25,25.75 125.25,22.5
  Bottom 0.254: v170.25,23.25 170.25,23.75 169.5,24.5 168.25,24.5 166.5,26.25 v166,26.25 | v145.5,19 v147.5,19
RFMOD_RST  (via drill 0.32)
  Top 0.254: IC1.10 180.25,32.25 179.75,32.75 172.75,32.75 171.75,31.75 171.75,29.75 171,29 153.5,29 153.25,29.25 v153.25,29.5 | v151,25 151,24.75 150.25,24 149,24 148.5,23.5 BT.11 145.5,23.5 145,23 145,19.75 144,18.75 130.75,18.75 130.5,19 130.5,20.75 129.75,21.5 129.75,27.75 129,28.5 125.75,28.5 125.5,28.25 | WIFI.1 105.75,30.5 105.5,30.25 105.5,26 106,25.5 109.25,25.5 109.75,26 116,26 117.5,27.5 124.75,27.5 125.5,28.25 | R9.1 126.15,25.35 v126,25.5 | v125.75,27.75 125.5,28 125.5,28.25
  Bottom 0.254: v151,25 151,26.25 151.25,26.5 152.5,26.5 152.75,26.25 153.5,26.25 153.75,26 154.25,26 154.75,26.5 154.75,27 153.25,28.5 v153.25,29.5 | v126,25.5 126,27.5 v125.75,27.75
SPI1_MOSI
  Top 0.254: IC1.17 175.75,27.75 173,25 168,25 153.75,10.75 153.75,8 153.5,7.75 150.5,7.75 150,7.25 JP2.3
SPI1_SCK
  Top 0.254: IC1.15 175.25,28.75 172.5,26 167.5,26 153.75,12.25 150.25,12.25 150,12 JP2.4
SWCLK
  Top 0.254: IC1.37 187.25,24.25 188.25,23.25 195.75,23.25 196,23.5 SWD.2
SWDIO
  Top 0.254: IC1.34 183.75,19.5 184.5,18.75 188,18.75 188.75,19.5 188.75,21.75 189.25,22.25 194.75,22.25 SWD.3
TRS_VCC
  Top 0.305: IC6.5 171.05,16.8 172,17.75 173.5,17.75 173.75,18 173.75,19.25 173.5,19.5 IC4.5
  Top 0.406: IC6.5 170.35,16.35 C10.1 168.35,16.35 168,16 168,10.5 | 168,10.5 168,10.45 TRS1.4 | 167.75,10.25 168,10.5
USART1_RX
  Top 0.254: IC1.31 182.25,21.5 182,21.25 177.5,21.25 177,20.75 177,19 176.55,18.55 IC4.1
USART1_TX
  Top 0.254: IC1.30 181.75,22 181.5,21.75 177.25,21.75 175.95,20.45 IC4.3
USART2_RX  (via drill 0.32)
  Top 0.254: IC1.13 174.75,29.75 172,27 154.25,27 v154,26.75 | v134.75,29.5 BT.2 125.5,29.5 124.5,30.5 WIFI.22
  Bottom 0.254: v154,26.75 154,27 153.25,27.75 152.75,27.75 152.5,27.5 136,27.5 134.75,28.75 v134.75,29.5
USART2_TX  (via drill 0.32)
  Top 0.254: IC1.12 177.75,31.25 v177.5,31.5 | v173.75,29.75 173.75,29.5 171.75,27.5 153.5,27.5 v153,27 | v134.75,26.5 BT.4 132,26.5 131.5,27 131.5,28 130.5,29 125.5,29 125,28.5 WIFI.21
  Bottom 0.254: v177.5,31.5 175.5,31.5 v173.75,29.75 | v153,27 136,27 135.5,26.5 v134.75,26.5
USB_DM
  Top 0.254: IC3.6 182.55,18.3 182.75,18.5 IC1.32
USB_DP
  Top 0.254: IC3.4 184.45,17.3 183.25,18.5 IC1.33
VBAT  (via drill 0.32)
  Top 0.254: IC1.1 v185.25,31.25
  Top 0.305: C11.1 186,32 v185.25,31.25 | v171.25,35.25 BAT1.POS
  Bottom 0.305: v185.25,31.25 180.75,31.25 179.25,32.75 173.75,32.75 v171.25,35.25

### Text on the board
tValues: GND | SWCLK | SWDIO | VCC | RST